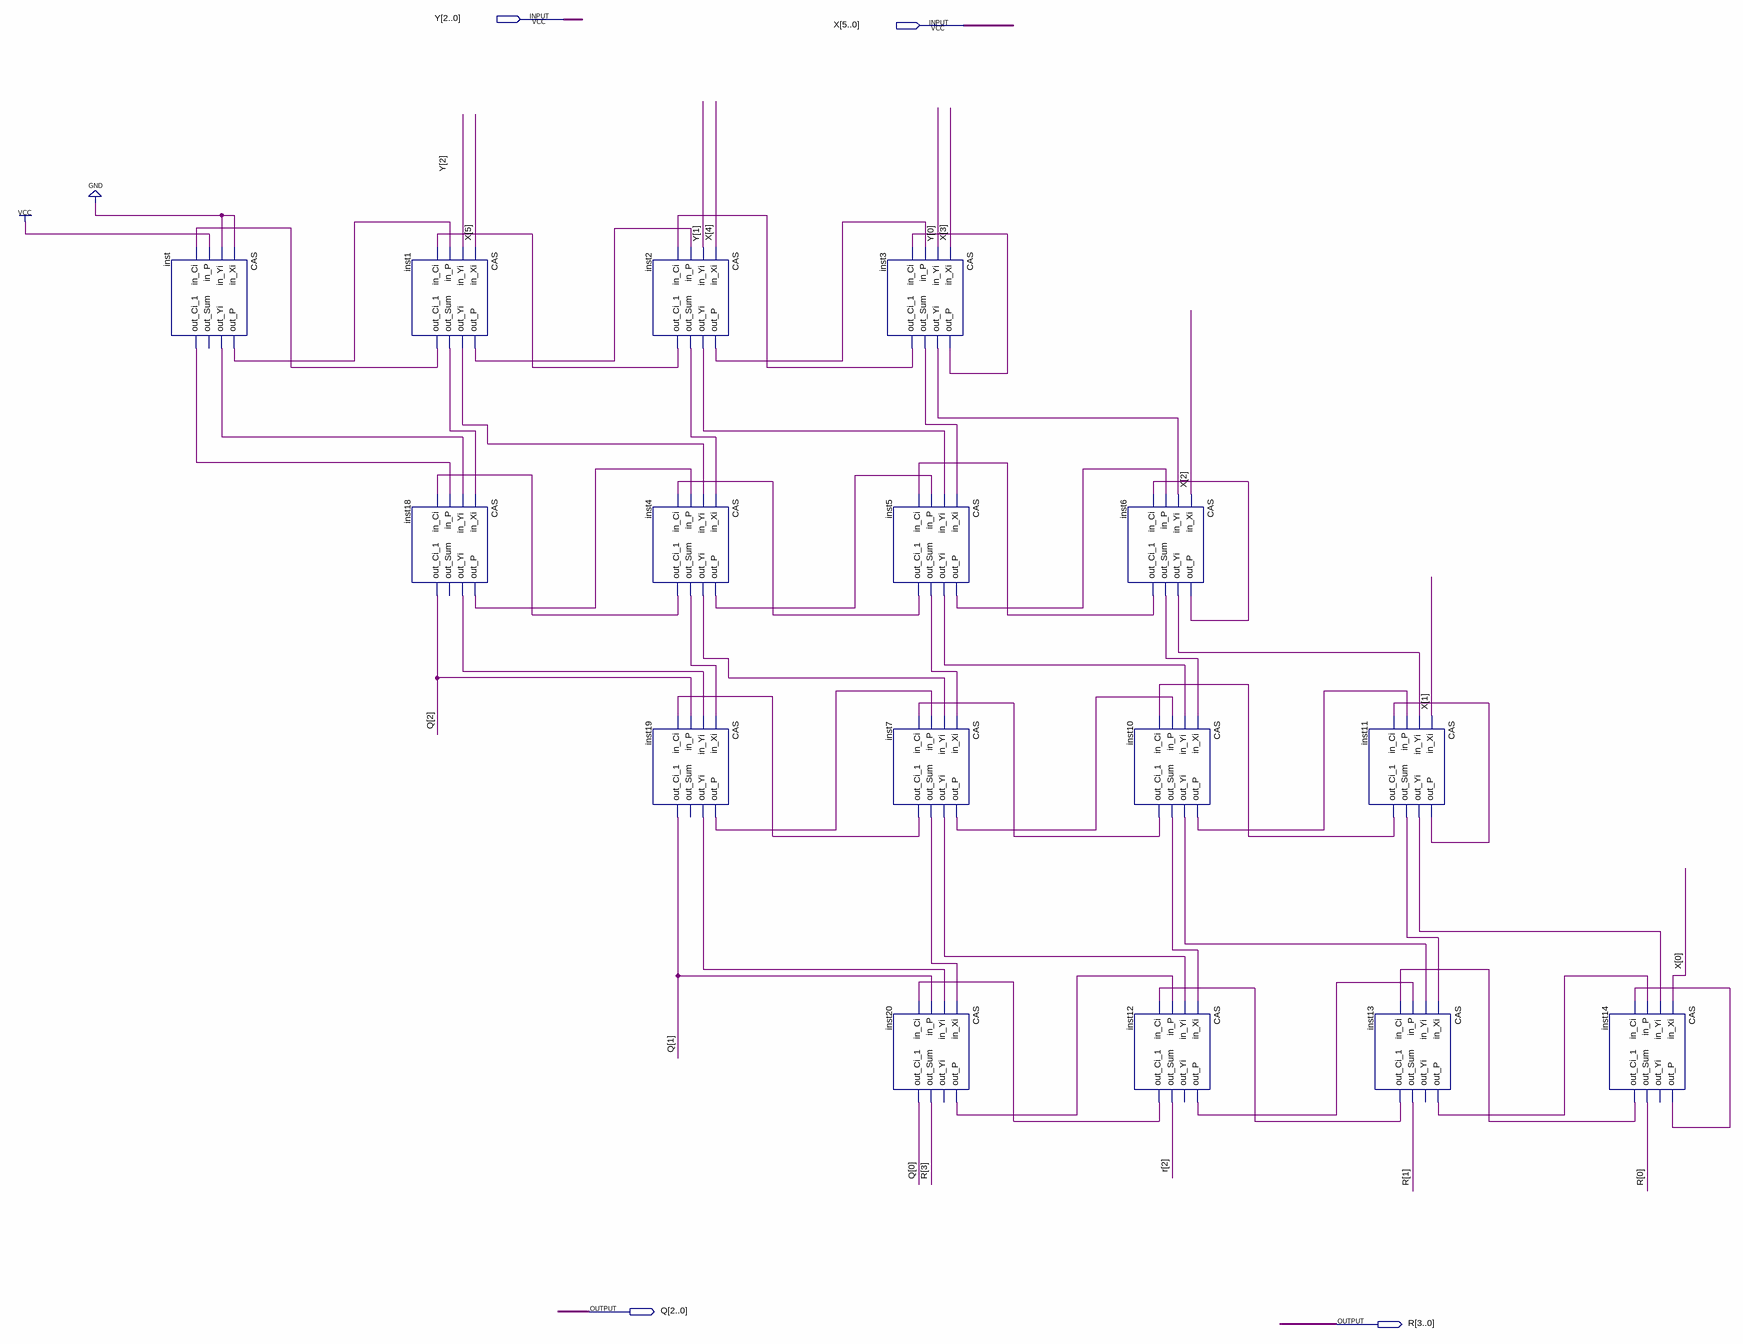
[diagram p0: schematic sheet]
// Quartus schematic div.bdf as structural Verilog: 16 symbols, 4 pins
module div (
  input  [2:0] Y,
  input  [5:0] X,
  output [2:0] Q,
  output [3:0] R
);

  wire inst1_out_ci_1, inst1_out_p, inst1_out_sum, inst1_out_yi, inst2_out_ci_1, inst2_out_p, inst2_out_sum,
       inst2_out_yi, inst3_out_ci_1, inst3_out_p, inst3_out_sum, inst3_out_yi, inst4_out_ci_1, inst4_out_p,
       inst4_out_sum, inst4_out_yi, inst5_out_ci_1, inst5_out_p, inst5_out_sum, inst5_out_yi, inst6_out_ci_1,
       inst6_out_p, inst6_out_sum, inst6_out_yi, inst7_out_ci_1, inst7_out_p, inst7_out_sum, inst7_out_yi,
       inst10_out_ci_1, inst10_out_p, inst10_out_sum, inst10_out_yi, inst11_out_ci_1, inst11_out_p,
       inst11_out_sum, inst11_out_yi, inst12_out_ci_1, inst12_out_p, inst13_out_ci_1, inst13_out_p,
       inst14_out_ci_1, inst14_out_p, inst18_out_p, inst18_out_yi, inst19_out_p, inst19_out_yi, inst20_out_p,
       inst_out_ci_1, inst_out_p, inst_out_yi;

  CAS inst (
    .in_Xi(1'b0), .in_Yi(1'b0), .in_P(1'b1), .in_Ci(inst1_out_ci_1), .out_P(inst_out_p),
    .out_Yi(inst_out_yi), .out_Ci_1(inst_out_ci_1));  // open: out_Sum
  CAS inst1 (
    .in_Xi(X[5]), .in_Yi(Y[2]), .in_P(inst_out_p), .in_Ci(inst2_out_ci_1), .out_P(inst1_out_p),
    .out_Yi(inst1_out_yi), .out_Sum(inst1_out_sum), .out_Ci_1(inst1_out_ci_1));
  CAS inst18 (
    .in_Xi(inst1_out_sum), .in_Yi(inst_out_yi), .in_P(inst_out_ci_1), .in_Ci(inst4_out_ci_1),
    .out_P(inst18_out_p), .out_Yi(inst18_out_yi), .out_Ci_1(Q[2]));  // open: out_Sum
  CAS inst2 (
    .in_Xi(X[4]), .in_Yi(Y[1]), .in_P(inst1_out_p), .in_Ci(inst3_out_ci_1), .out_P(inst2_out_p),
    .out_Yi(inst2_out_yi), .out_Sum(inst2_out_sum), .out_Ci_1(inst2_out_ci_1));
  CAS inst4 (
    .in_Xi(inst2_out_sum), .in_Yi(inst1_out_yi), .in_P(inst18_out_p), .in_Ci(inst5_out_ci_1),
    .out_P(inst4_out_p), .out_Yi(inst4_out_yi), .out_Sum(inst4_out_sum), .out_Ci_1(inst4_out_ci_1));
  CAS inst19 (
    .in_Xi(inst4_out_sum), .in_Yi(inst18_out_yi), .in_P(Q[2]), .in_Ci(inst7_out_ci_1), .out_P(inst19_out_p),
    .out_Yi(inst19_out_yi), .out_Ci_1(Q[1]));  // open: out_Sum
  CAS inst3 (
    .in_Xi(X[3]), .in_Yi(Y[0]), .in_P(inst2_out_p), .in_Ci(inst3_out_p), .out_P(inst3_out_p),
    .out_Yi(inst3_out_yi), .out_Sum(inst3_out_sum), .out_Ci_1(inst3_out_ci_1));
  CAS inst5 (
    .in_Xi(inst3_out_sum), .in_Yi(inst2_out_yi), .in_P(inst4_out_p), .in_Ci(inst6_out_ci_1),
    .out_P(inst5_out_p), .out_Yi(inst5_out_yi), .out_Sum(inst5_out_sum), .out_Ci_1(inst5_out_ci_1));
  CAS inst7 (
    .in_Xi(inst5_out_sum), .in_Yi(inst4_out_yi), .in_P(inst19_out_p), .in_Ci(inst10_out_ci_1),
    .out_P(inst7_out_p), .out_Yi(inst7_out_yi), .out_Sum(inst7_out_sum), .out_Ci_1(inst7_out_ci_1));
  CAS inst20 (
    .in_Xi(inst7_out_sum), .in_Yi(inst19_out_yi), .in_P(Q[1]), .in_Ci(inst12_out_ci_1), .out_P(inst20_out_p),
    .out_Sum(R[3]), .out_Ci_1(Q[0]));  // open: out_Yi
  CAS inst6 (
    .in_Xi(X[2]), .in_Yi(inst3_out_yi), .in_P(inst5_out_p), .in_Ci(inst6_out_p), .out_P(inst6_out_p),
    .out_Yi(inst6_out_yi), .out_Sum(inst6_out_sum), .out_Ci_1(inst6_out_ci_1));
  CAS inst10 (
    .in_Xi(inst6_out_sum), .in_Yi(inst5_out_yi), .in_P(inst7_out_p), .in_Ci(inst11_out_ci_1),
    .out_P(inst10_out_p), .out_Yi(inst10_out_yi), .out_Sum(inst10_out_sum), .out_Ci_1(inst10_out_ci_1));
  CAS inst12 (
    .in_Xi(inst10_out_sum), .in_Yi(inst7_out_yi), .in_P(inst20_out_p), .in_Ci(inst13_out_ci_1),
    .out_P(inst12_out_p), .out_Sum(R[2]), .out_Ci_1(inst12_out_ci_1));  // open: out_Yi
  CAS inst11 (
    .in_Xi(X[1]), .in_Yi(inst6_out_yi), .in_P(inst10_out_p), .in_Ci(inst11_out_p), .out_P(inst11_out_p),
    .out_Yi(inst11_out_yi), .out_Sum(inst11_out_sum), .out_Ci_1(inst11_out_ci_1));
  CAS inst13 (
    .in_Xi(inst11_out_sum), .in_Yi(inst10_out_yi), .in_P(inst12_out_p), .in_Ci(inst14_out_ci_1),
    .out_P(inst13_out_p), .out_Sum(R[1]), .out_Ci_1(inst13_out_ci_1));  // open: out_Yi
  CAS inst14 (
    .in_Xi(X[0]), .in_Yi(inst11_out_yi), .in_P(inst13_out_p), .in_Ci(inst14_out_p), .out_P(inst14_out_p),
    .out_Sum(R[0]), .out_Ci_1(inst14_out_ci_1));  // open: out_Yi
endmodule
